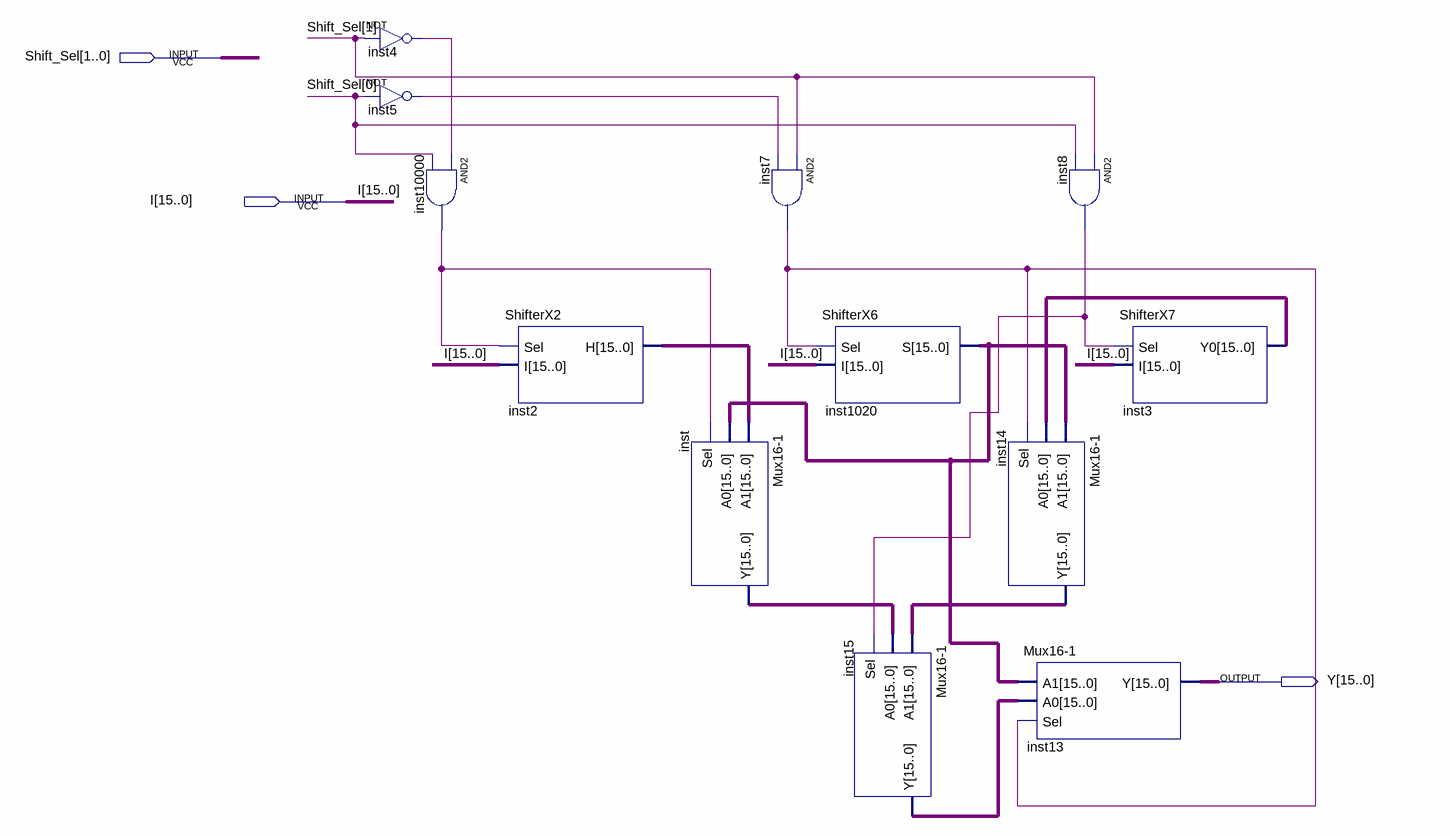
[diagram p0: schematic sheet]
// Quartus schematic Shifter.bdf as structural Verilog: 12 symbols, 3 pins
module Shifter (
  input  [1:0] Shift_Sel,
  input  [15:0] I,
  output [15:0] Y
);

  wire inst4_out, inst5_out, inst7_out, inst8_out, inst10000_out;
  wire [15:0] inst2_h, inst3_y0, inst14_y, inst15_y, inst1020_s, inst_y;

  not inst4 (inst4_out, Shift_Sel[1]);
  not inst5 (inst5_out, Shift_Sel[0]);
  and inst10000 (inst10000_out, inst4_out, Shift_Sel[0]);
  ShifterX2 inst2 (.Sel(inst10000_out), .I(I), .H(inst2_h));
  \Mux16-1  inst (.A1(inst2_h), .A0(inst1020_s), .Sel(inst10000_out), .Y(inst_y));
  and inst7 (inst7_out, Shift_Sel[1], inst5_out);
  ShifterX6 inst1020 (.Sel(inst7_out), .I(I), .S(inst1020_s));
  \Mux16-1  inst15 (.A1(inst14_y), .A0(inst_y), .Sel(inst8_out), .Y(inst15_y));
  \Mux16-1  inst14 (.A1(inst1020_s), .A0(inst3_y0), .Sel(inst7_out), .Y(inst14_y));
  \Mux16-1  inst13 (.A1(inst1020_s), .A0(inst15_y), .Sel(inst7_out), .Y(Y));
  and inst8 (inst8_out, Shift_Sel[1], Shift_Sel[0]);
  ShifterX7 inst3 (.Sel(inst8_out), .I(I), .Y0(inst3_y0));
endmodule
